# Altium schematic sheet P_RAM_integr.SchDoc
size 420 x 297 mm; Author: ALTIUM GOSTBOM2.0 KEV; SheetNumber: 27; SheetTotal: 48
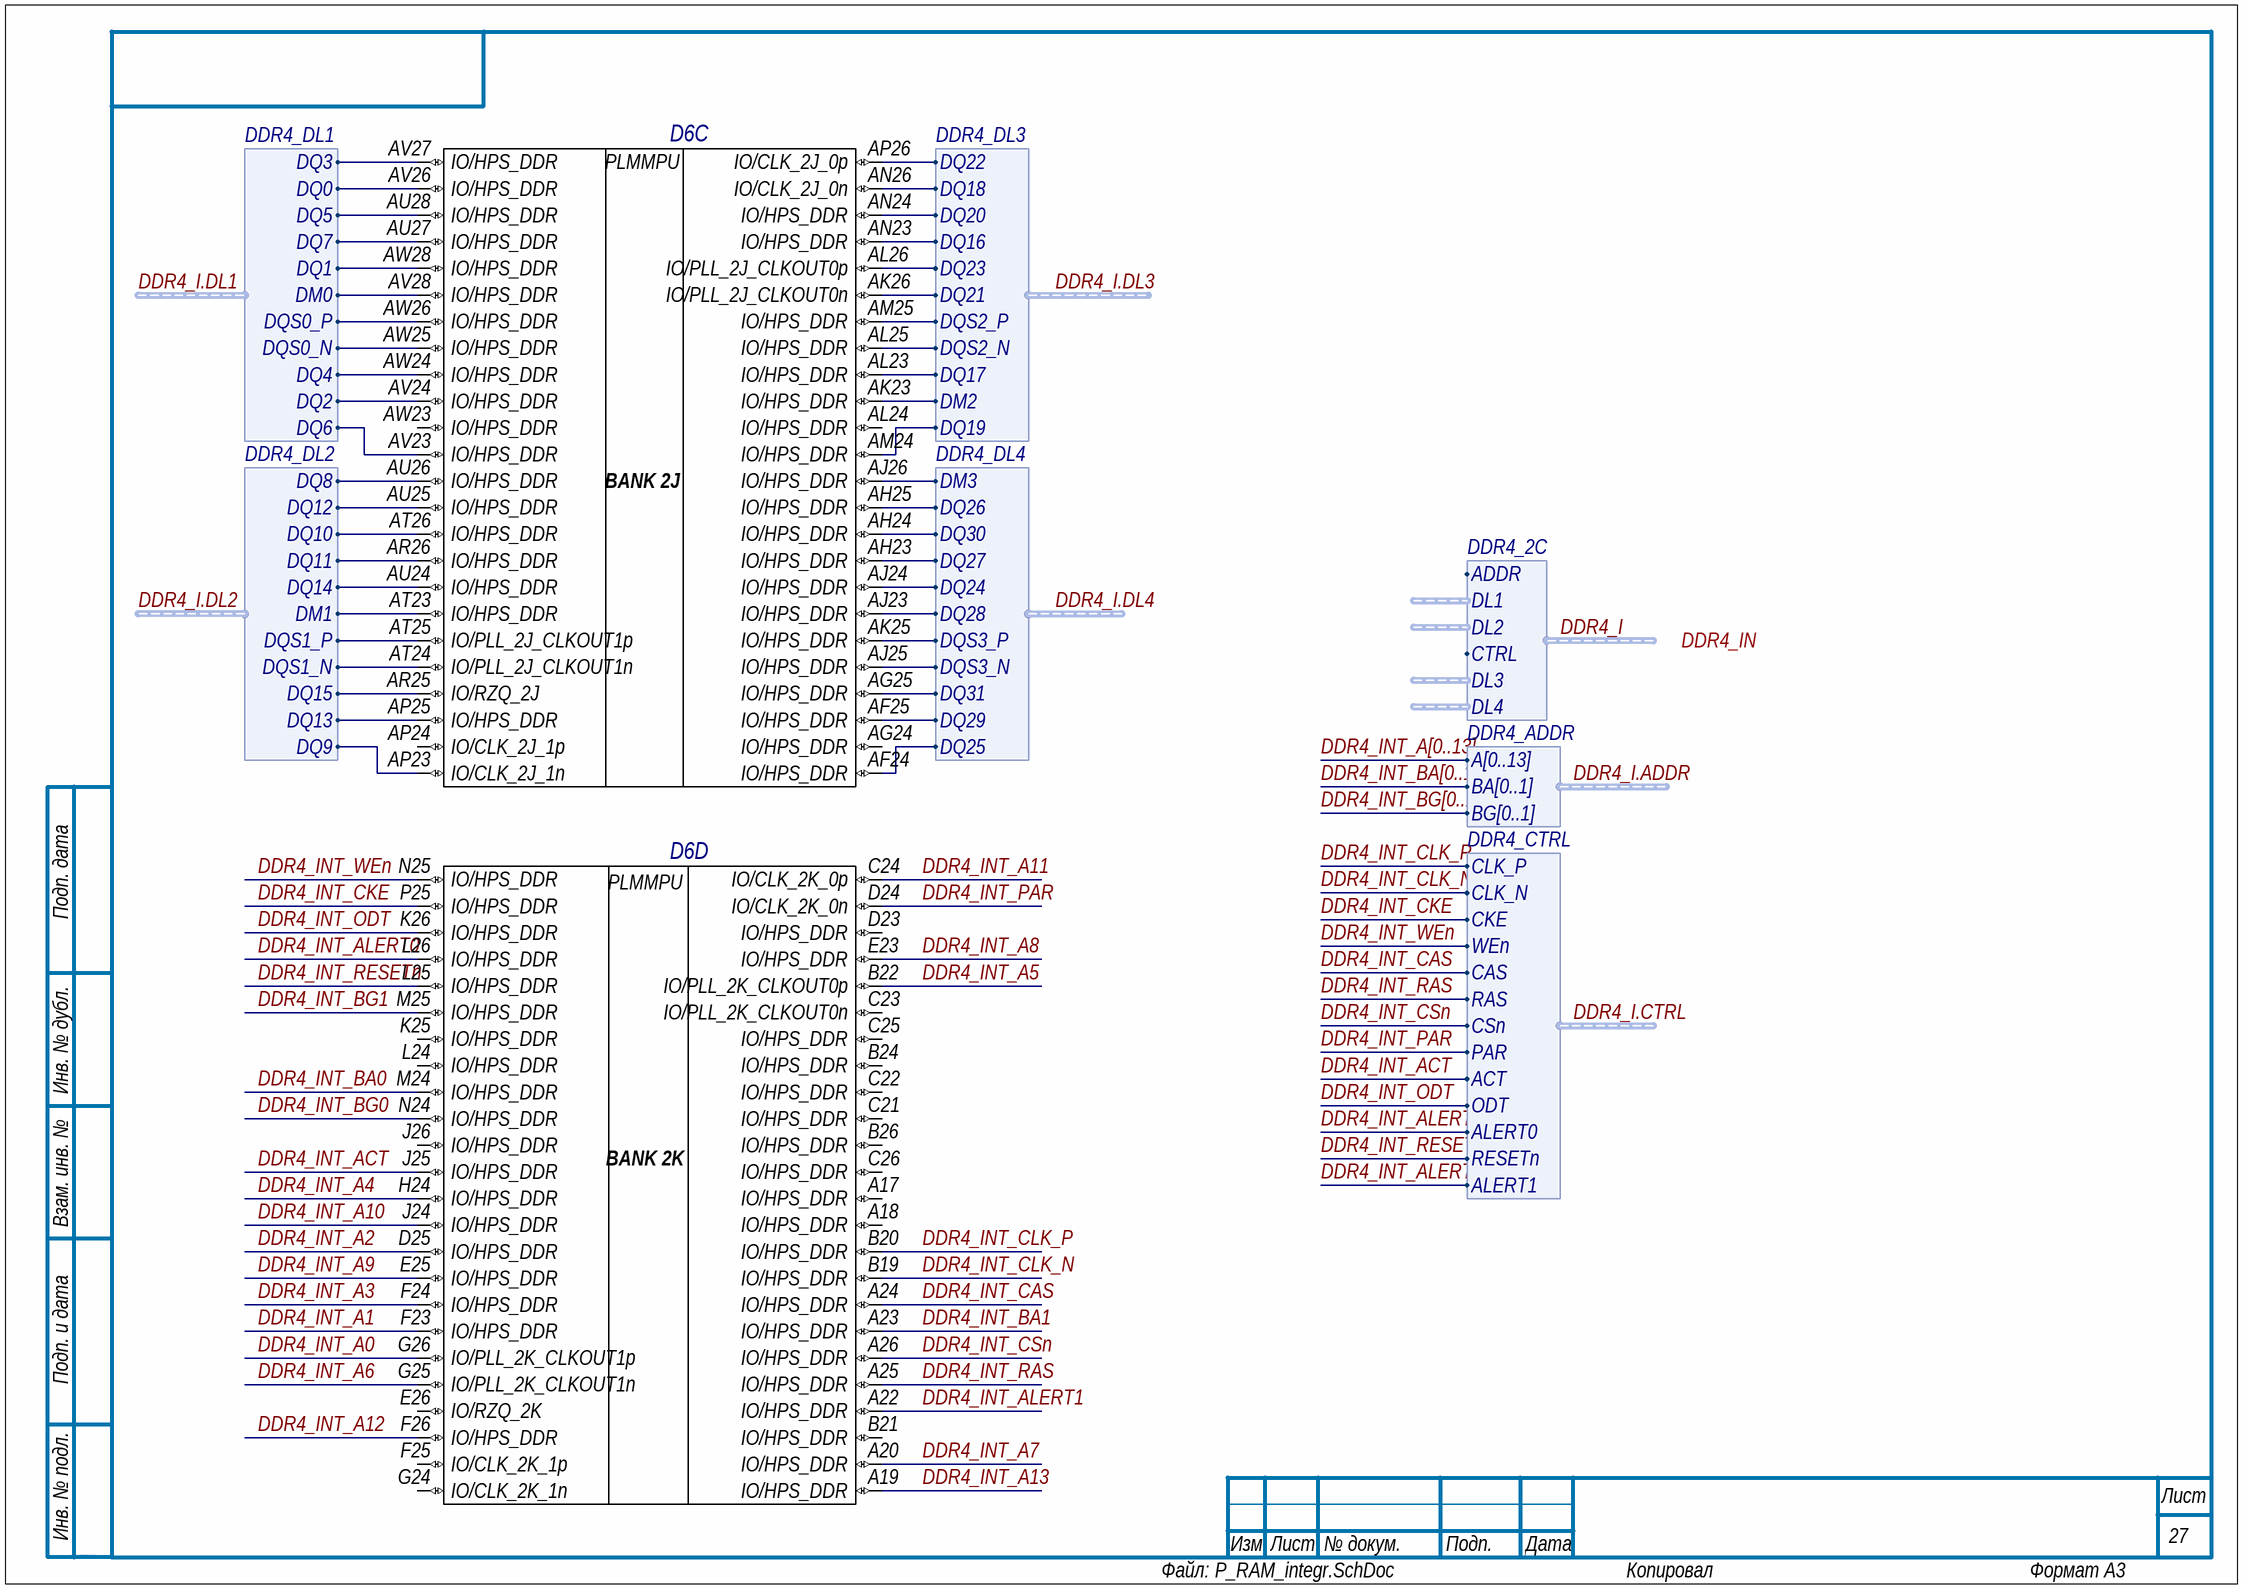
[diagram p0: P_RAM_integr.SchDoc]

## Parts
D6  10AS066N3F40E2SGE2  [ALTR-FBGA1517_A-350]  (value not drawn)  (parts C,D of 39)

## Ports
DDR4_IN (harness DDR4_2C)

## Harnesses
DDR4_2C: ADDR, DL1, DL2, CTRL, DL3, DL4
DDR4_ADDR: A[0..13], BA[0..1], BG[0..1]
DDR4_CTRL: CLK_P, CLK_N, CKE, WEn, CAS, RAS, CSn, PAR, ACT, ODT, ALERT0, RESETn, ALERT1
DDR4_DL1: DQ0, DQ1, DQ2, DQ3, DQ4, DQ5, DQ6, DQ7, DM0, DQS0_P, DQS0_N
DDR4_DL2: DQ8, DQ9, DQ10, DQ11, DQ12, DQ13, DQ14, DQ15, DM1, DQS1_P, DQS1_N
DDR4_DL3: DQ16, DQ17, DQ18, DQ19, DQ20, DQ21, DQ22, DQ23, DM2, DQS2_P, DQS2_N
DDR4_DL4: DQ24, DQ25, DQ26, DQ27, DQ28, DQ29, DQ30, DQ31, DM3, DQS3_P, DQS3_N

## Nets
DDR4_I.DL1.DM0: D6.AV28(IO/HPS_DDR) ; harness DDR4_DL1.DM0
DDR4_I.DL1.DQ0: D6.AV26(IO/HPS_DDR) ; harness DDR4_DL1.DQ0
DDR4_I.DL1.DQ1: D6.AW28(IO/HPS_DDR) ; harness DDR4_DL1.DQ1
DDR4_I.DL1.DQ2: D6.AV24(IO/HPS_DDR) ; harness DDR4_DL1.DQ2
DDR4_I.DL1.DQ3: D6.AV27(IO/HPS_DDR) ; harness DDR4_DL1.DQ3
DDR4_I.DL1.DQ4: D6.AW24(IO/HPS_DDR) ; harness DDR4_DL1.DQ4
DDR4_I.DL1.DQ5: D6.AU28(IO/HPS_DDR) ; harness DDR4_DL1.DQ5
DDR4_I.DL1.DQ6: D6.AV23(IO/HPS_DDR) ; harness DDR4_DL1.DQ6
DDR4_I.DL1.DQ7: D6.AU27(IO/HPS_DDR) ; harness DDR4_DL1.DQ7
DDR4_I.DL1.DQS0_N: D6.AW25(IO/HPS_DDR) ; harness DDR4_DL1.DQS0_N
DDR4_I.DL1.DQS0_P: D6.AW26(IO/HPS_DDR) ; harness DDR4_DL1.DQS0_P
DDR4_I.DL2.DM1: D6.AT23(IO/HPS_DDR) ; harness DDR4_DL2.DM1
DDR4_I.DL2.DQ8: D6.AU26(IO/HPS_DDR) ; harness DDR4_DL2.DQ8
DDR4_I.DL2.DQ9: D6.AP23(IO/CLK_2J_1n) ; harness DDR4_DL2.DQ9
DDR4_I.DL2.DQ10: D6.AT26(IO/HPS_DDR) ; harness DDR4_DL2.DQ10
DDR4_I.DL2.DQ11: D6.AR26(IO/HPS_DDR) ; harness DDR4_DL2.DQ11
DDR4_I.DL2.DQ12: D6.AU25(IO/HPS_DDR) ; harness DDR4_DL2.DQ12
DDR4_I.DL2.DQ13: D6.AP25(IO/HPS_DDR) ; harness DDR4_DL2.DQ13
DDR4_I.DL2.DQ14: D6.AU24(IO/HPS_DDR) ; harness DDR4_DL2.DQ14
DDR4_I.DL2.DQ15: D6.AR25(IO/RZQ_2J) ; harness DDR4_DL2.DQ15
DDR4_I.DL2.DQS1_N: D6.AT24(IO/PLL_2J_CLKOUT1n) ; harness DDR4_DL2.DQS1_N
DDR4_I.DL2.DQS1_P: D6.AT25(IO/PLL_2J_CLKOUT1p) ; harness DDR4_DL2.DQS1_P
DDR4_I.DL3.DM2: D6.AK23(IO/HPS_DDR) ; harness DDR4_DL3.DM2
DDR4_I.DL3.DQ16: D6.AN23(IO/HPS_DDR) ; harness DDR4_DL3.DQ16
DDR4_I.DL3.DQ17: D6.AL23(IO/HPS_DDR) ; harness DDR4_DL3.DQ17
DDR4_I.DL3.DQ18: D6.AN26(IO/CLK_2J_0n) ; harness DDR4_DL3.DQ18
DDR4_I.DL3.DQ19: D6.AM24(IO/HPS_DDR) ; harness DDR4_DL3.DQ19
DDR4_I.DL3.DQ20: D6.AN24(IO/HPS_DDR) ; harness DDR4_DL3.DQ20
DDR4_I.DL3.DQ21: D6.AK26(IO/PLL_2J_CLKOUT0n) ; harness DDR4_DL3.DQ21
DDR4_I.DL3.DQ22: D6.AP26(IO/CLK_2J_0p) ; harness DDR4_DL3.DQ22
DDR4_I.DL3.DQ23: D6.AL26(IO/PLL_2J_CLKOUT0p) ; harness DDR4_DL3.DQ23
DDR4_I.DL3.DQS2_N: D6.AL25(IO/HPS_DDR) ; harness DDR4_DL3.DQS2_N
DDR4_I.DL3.DQS2_P: D6.AM25(IO/HPS_DDR) ; harness DDR4_DL3.DQS2_P
DDR4_I.DL4.DM3: D6.AJ26(IO/HPS_DDR) ; harness DDR4_DL4.DM3
DDR4_I.DL4.DQ24: D6.AJ24(IO/HPS_DDR) ; harness DDR4_DL4.DQ24
DDR4_I.DL4.DQ25: D6.AF24(IO/HPS_DDR) ; harness DDR4_DL4.DQ25
DDR4_I.DL4.DQ26: D6.AH25(IO/HPS_DDR) ; harness DDR4_DL4.DQ26
DDR4_I.DL4.DQ27: D6.AH23(IO/HPS_DDR) ; harness DDR4_DL4.DQ27
DDR4_I.DL4.DQ28: D6.AJ23(IO/HPS_DDR) ; harness DDR4_DL4.DQ28
DDR4_I.DL4.DQ29: D6.AF25(IO/HPS_DDR) ; harness DDR4_DL4.DQ29
DDR4_I.DL4.DQ30: D6.AH24(IO/HPS_DDR) ; harness DDR4_DL4.DQ30
DDR4_I.DL4.DQ31: D6.AG25(IO/HPS_DDR) ; harness DDR4_DL4.DQ31
DDR4_I.DL4.DQS3_N: D6.AJ25(IO/HPS_DDR) ; harness DDR4_DL4.DQS3_N
DDR4_I.DL4.DQS3_P: D6.AK25(IO/HPS_DDR) ; harness DDR4_DL4.DQS3_P
DDR4_INT_A0: D6.G26(IO/PLL_2K_CLKOUT1p)
DDR4_INT_A1: D6.F23(IO/HPS_DDR)
DDR4_INT_A2: D6.D25(IO/HPS_DDR)
DDR4_INT_A3: D6.F24(IO/HPS_DDR)
DDR4_INT_A4: D6.H24(IO/HPS_DDR)
DDR4_INT_A5: D6.B22(IO/PLL_2K_CLKOUT0p)
DDR4_INT_A6: D6.G25(IO/PLL_2K_CLKOUT1n)
DDR4_INT_A7: D6.A20(IO/HPS_DDR)
DDR4_INT_A8: D6.E23(IO/HPS_DDR)
DDR4_INT_A9: D6.E25(IO/HPS_DDR)
DDR4_INT_A10: D6.J24(IO/HPS_DDR)
DDR4_INT_A11: D6.C24(IO/CLK_2K_0p)
DDR4_INT_A12: D6.F26(IO/HPS_DDR)
DDR4_INT_A13: D6.A19(IO/HPS_DDR)
DDR4_INT_ACT: D6.J25(IO/HPS_DDR) ; harness DDR4_CTRL.ACT  [project net DDR4_I.CTRL.ACT]
DDR4_INT_ALERT0: D6.L26(IO/HPS_DDR) ; harness DDR4_CTRL.ALERT0  [project net DDR4_I.CTRL.ALERT0]
DDR4_INT_ALERT1: D6.A22(IO/HPS_DDR) ; harness DDR4_CTRL.ALERT1  [project net DDR4_I.CTRL.ALERT1]
DDR4_INT_BA0: D6.M24(IO/HPS_DDR)
DDR4_INT_BA1: D6.A23(IO/HPS_DDR)
DDR4_INT_BG0: D6.N24(IO/HPS_DDR)
DDR4_INT_BG1: D6.M25(IO/HPS_DDR)
DDR4_INT_CAS: D6.A24(IO/HPS_DDR) ; harness DDR4_CTRL.CAS  [project net DDR4_I.CTRL.CAS]
DDR4_INT_CKE: D6.P25(IO/HPS_DDR) ; harness DDR4_CTRL.CKE  [project net DDR4_I.CTRL.CKE]
DDR4_INT_CLK_N: D6.B19(IO/HPS_DDR) ; harness DDR4_CTRL.CLK_N  [project net DDR4_I.CTRL.CLK_N]
DDR4_INT_CLK_P: D6.B20(IO/HPS_DDR) ; harness DDR4_CTRL.CLK_P  [project net DDR4_I.CTRL.CLK_P]
DDR4_INT_CSn: D6.A26(IO/HPS_DDR) ; harness DDR4_CTRL.CSn  [project net DDR4_I.CTRL.CSn]
DDR4_INT_ODT: D6.K26(IO/HPS_DDR) ; harness DDR4_CTRL.ODT  [project net DDR4_I.CTRL.ODT]
DDR4_INT_PAR: D6.D24(IO/CLK_2K_0n) ; harness DDR4_CTRL.PAR  [project net DDR4_I.CTRL.PAR]
DDR4_INT_RAS: D6.A25(IO/HPS_DDR) ; harness DDR4_CTRL.RAS  [project net DDR4_I.CTRL.RAS]
DDR4_INT_RESETn: D6.L25(IO/HPS_DDR) ; harness DDR4_CTRL.RESETn  [project net DDR4_I.CTRL.RESETn]
DDR4_INT_WEn: D6.N25(IO/HPS_DDR) ; harness DDR4_CTRL.WEn  [project net DDR4_I.CTRL.WEn]

Not connected (* = marked no-connect by the designer): D6 A17(IO/HPS_DDR) A18(IO/HPS_DDR) AG24(IO/HPS_DDR) AL24(IO/HPS_DDR) AP24(IO/CLK_2J_1p) AW23(IO/HPS_DDR) B21(IO/HPS_DDR) B24(IO/HPS_DDR) B26(IO/HPS_DDR) C21(IO/HPS_DDR) C22(IO/HPS_DDR) C23(IO/PLL_2K_CLKOUT0n) C25(IO/HPS_DDR) C26(IO/HPS_DDR) D23(IO/HPS_DDR) E26(IO/RZQ_2K) F25(IO/CLK_2K_1p) G24(IO/CLK_2K_1n) J26(IO/HPS_DDR) K25(IO/HPS_DDR) L24(IO/HPS_DDR)

## Buses and harness runs
bus DDR4_INT_A[0..13]
bus DDR4_INT_BA[0..1]
bus DDR4_INT_BG[0..1]
harness DDR4_I = port DDR4_IN

## Notes on the sheet
- Подп. дата
- Инв. № дубл.
- Взам. инв. №
- Подп. и дата
- Инв. № подл.
- Изм.
- Лист
- № докум.
- Подп.
- Дата
- ALTIUM GOSTBOM2.0 KEV
- Файл:
- Копировал
- Формат А3
- (in symbol E105, part C) PLMMPU; BANK 2J
- (in symbol E105, part D) PLMMPU; BANK 2K

## Library data of the parts
D6 = E105: Arria 10 SX Family, 588 I/O Pins, 16 Fractional PLLs, 1517-Pin FBGA, Speed Grade 2, Extended Grade, RoHS; Тип элемента: ПЛИС; Old_des: U1; New_des: D6; UID: E105; Component Kind: Standard; ComponentLink1Description: Manufacturer URL; ComponentLink1URL: https://www.altera.com/; ComponentLink2Description: Datasheet; ComponentLink2URL: https://www.altera.com/content/dam/altera-www/global/en_US/pdfs/literature/hb/arria-10/a10_datasheet.pdf; DatasheetVersion: Rev. 2016-06-24, 06/2016; Mounting Technology: Surface Mount; PackageDescription: 1517-Pin FineLine Ball-Grid Array (FBGA), Body 40 x 40 mm, Pitch 1 mm; PartNumber: 10AS066N3F40E2SGE2; Code_JEDEC: MS-034; ComponentLink3Description: Package Specification; ComponentLink3URL: https://www.altera.com/content/dam/altera-www/global/en_US/pdfs/literature/packaging/04r00461-04.pdf; PackageVersion: Rev. 5.0, 01/2016